# EAGLE design 8channelrelaydriver_smd (EAGLE 7.2.0)
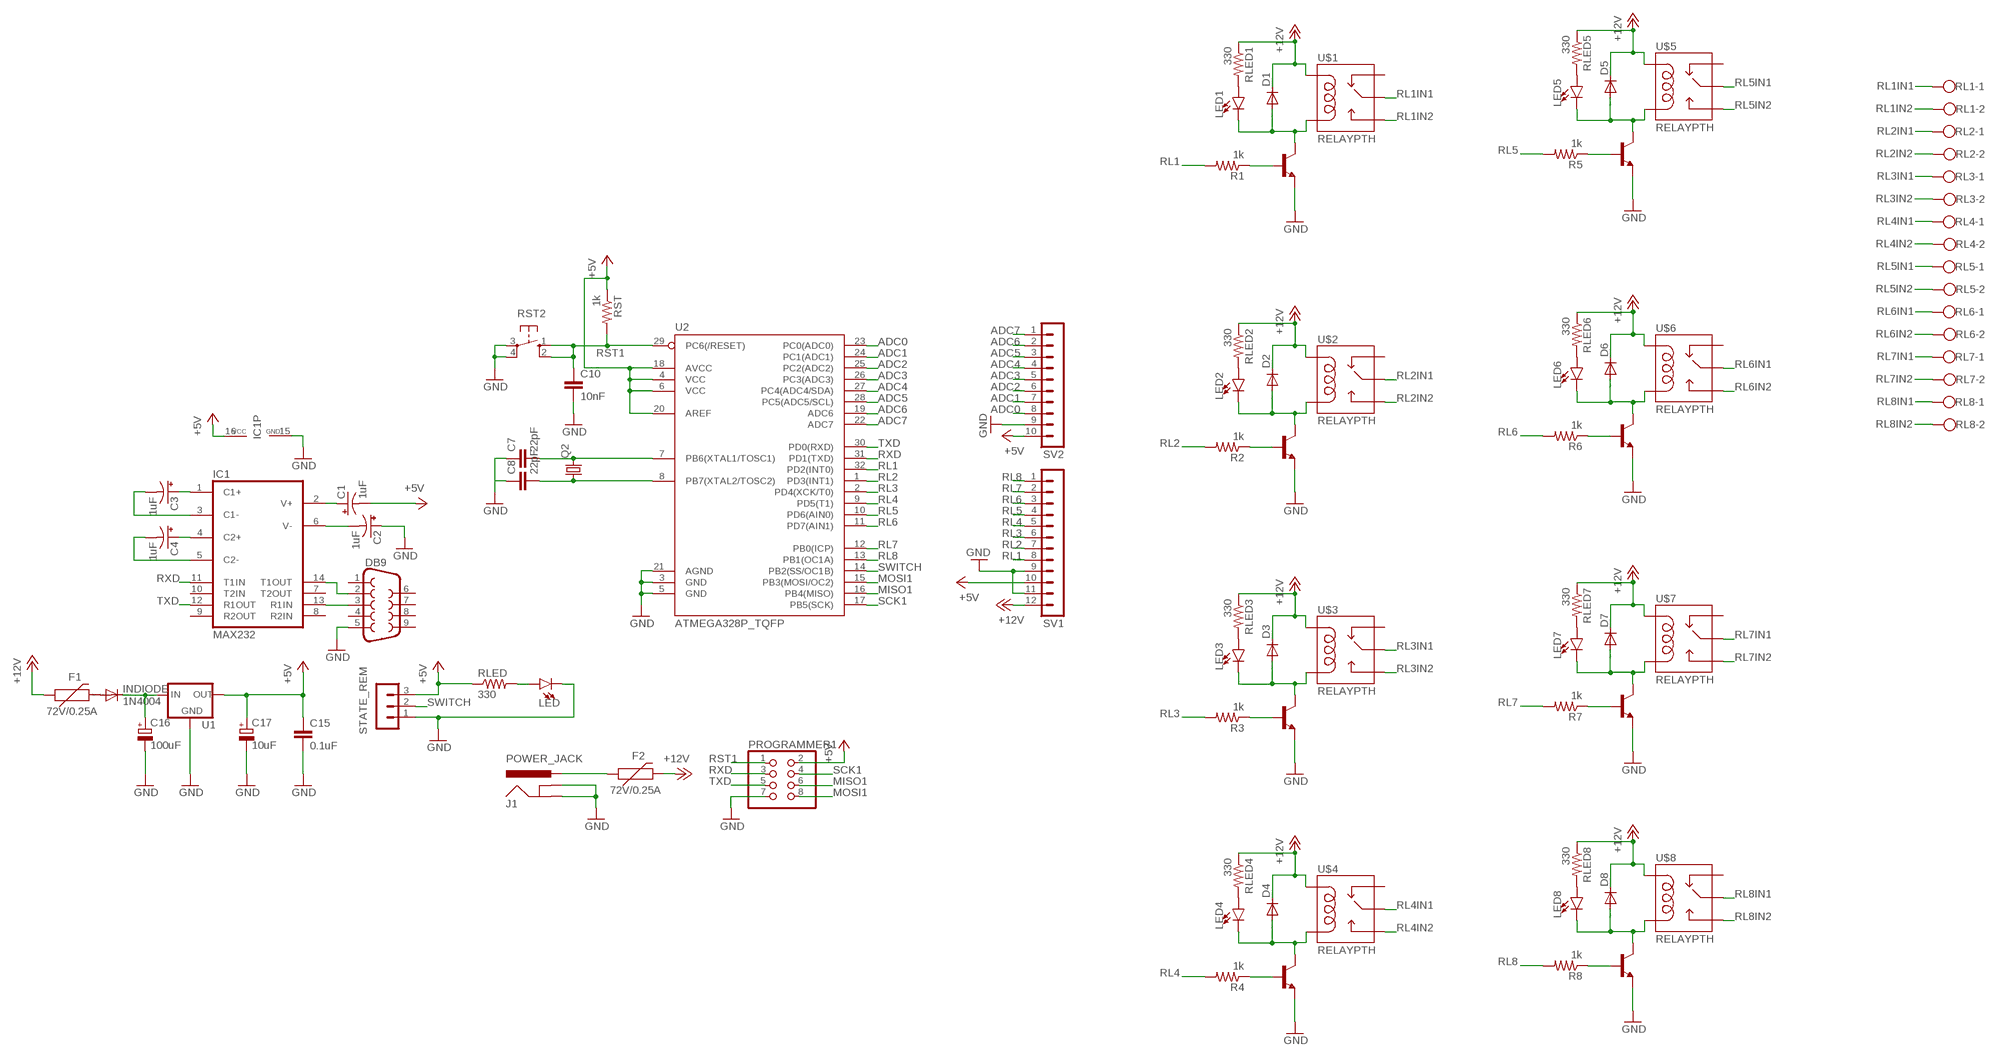
[diagram p0: schematic, sheet 1]

## Parts
C1  1uF  CPOL-USE2.5-6  [E2,5-6]
C2  1uF  CPOL-USE2.5-6  [E2,5-6]
C3  1uF  CPOL-USE2.5-6  [E2,5-6]
C4  1uF  CPOL-USE2.5-6  [E2,5-6]
C7  22pF  C-EUC1206  [C1206]
C8  22pF  C-EUC1206  [C1206]
C10  10nF  C-EUC1206  [C1206]
C15  0.1uF  C-EUC1206  [C1206]
C16  100uF  CPOL-EUE2.5-6  [E2,5-6]
C17  10uF  CPOL-EUE2.5-6  [E2,5-6]
D1  1N4004  [DO41-10]
D2  1N4004  [DO41-10]
D3  1N4004  [DO41-10]
D4  1N4004  [DO41-10]
D5  1N4004  [DO41-10]
D6  1N4004  [DO41-10]
D7  1N4004  [DO41-10]
D8  1N4004  [DO41-10]
DB9  DB9FEMALE  [DB9]
F1  72V/0.25A  PPTC_PTH  [PTH]
F2  72V/0.25A  PPTC_PTH  [PTH]
IC1  MAX232  [DIL16]
INDIODE  1N4004  [DO41-10]
J1  POWER_JACK  [POWER_JACK_PTH]
LED  LED5MM  [LED_5MM]
LED1  LED5MM  [LED_5MM]
LED2  LED5MM  [LED_5MM]
LED3  LED5MM  [LED_5MM]
LED4  LED5MM  [LED_5MM]
LED5  LED5MM  [LED_5MM]
LED6  LED5MM  [LED_5MM]
LED7  LED5MM  [LED_5MM]
LED8  LED5MM  [LED_5MM]
PROGRAMMER1  PINHD-2X4  [2X04]
Q2  CRYSTALHC49U70  [HC49U70]
R1  1k  R-US_M1206  [M1206]
R2  1k  R-US_M1206  [M1206]
R3  1k  R-US_M1206  [M1206]
R4  1k  R-US_M1206  [M1206]
R5  1k  R-US_M1206  [M1206]
R6  1k  R-US_M1206  [M1206]
R7  1k  R-US_M1206  [M1206]
R8  1k  R-US_M1206  [M1206]
RL1  W237-102  [W237-102]
RL2  W237-102  [W237-102]
RL3  W237-102  [W237-102]
RL4  W237-102  [W237-102]
RL5  W237-102  [W237-102]
RL6  W237-102  [W237-102]
RL7  W237-102  [W237-102]
RL8  W237-102  [W237-102]
RLED  330  R-US_M1206  [M1206]
RLED1  330  R-US_M1206  [M1206]
RLED2  330  R-US_M1206  [M1206]
RLED3  330  R-US_M1206  [M1206]
RLED4  330  R-US_M1206  [M1206]
RLED5  330  R-US_M1206  [M1206]
RLED6  330  R-US_M1206  [M1206]
RLED7  330  R-US_M1206  [M1206]
RLED8  330  R-US_M1206  [M1206]
RST  1k  R-US_M1206  [M1206]
RST2  10-XX  [B3F-10XX]
STATE_REM  MA03-1  [MA03-1]
SV1  MA12-1  [MA12-1]
SV2  MA10-1  [MA10-1]
T1  BC847  [SOT23]
T2  BC847  [SOT23]
T3  BC847  [SOT23]
T4  BC847  [SOT23]
T5  BC847  [SOT23]
T6  BC847  [SOT23]
T7  BC847  [SOT23]
T8  BC847  [SOT23]
U1  V_REG_78XXSIDE  [78XXL]
U2  ATMEGA328P_TQFP  [TQFP32-08]
U$1  RELAYPTH  [SRD-05VDC-SL-C]
U$2  RELAYPTH  [SRD-05VDC-SL-C]
U$3  RELAYPTH  [SRD-05VDC-SL-C]
U$4  RELAYPTH  [SRD-05VDC-SL-C]
U$5  RELAYPTH  [SRD-05VDC-SL-C]
U$6  RELAYPTH  [SRD-05VDC-SL-C]
U$7  RELAYPTH  [SRD-05VDC-SL-C]
U$8  RELAYPTH  [SRD-05VDC-SL-C]

## Nets
+12V: D1.C D2.C D3.C D4.C D5.C D6.C D7.C D8.C F1.P$1 F2.P$2 RLED1.1 RLED2.1 RLED3.1 RLED4.1 RLED5.1 RLED6.1 RLED7.1 RLED8.1 SV1.12 U$1.COIL1 U$2.COIL1 U$3.COIL1 U$4.COIL1 U$5.COIL1 U$6.COIL1 U$7.COIL1 U$8.COIL1
ADC0: SV2.8 U2.23(PC0(ADC0))
ADC1: SV2.7 U2.24(PC1(ADC1))
ADC2: SV2.6 U2.25(PC2(ADC2))
ADC3: SV2.5 U2.26(PC3(ADC3))
ADC4: SV2.4 U2.27(PC4(ADC4/SDA))
ADC5: SV2.3 U2.28(PC5(ADC5/SCL))
ADC6: SV2.2 U2.19(ADC6)
ADC7: SV2.1 U2.22(ADC7)
MISO1: PROGRAMMER1.6 U2.16(PB4(MISO))
MOSI1: PROGRAMMER1.8 U2.15(PB3(MOSI/OC2))
N$1: DB9.2 IC1.14(T1OUT)
N$2: LED.A RLED.2
N$3: C16.+ INDIODE.C U1.IN
N$4: D2.A LED2.K(C) T2.3(C) U$2.COIL0
N$5: D1.A LED1.K(C) T1.3(C) U$1.COIL0
N$6: R1.1 T1.1(B)
N$7: R2.1 T2.1(B)
N$8: D3.A LED3.K(C) T3.3(C) U$3.COIL0
N$9: R3.1 T3.1(B)
N$10: D4.A LED4.K(C) T4.3(C) U$4.COIL0
N$11: R4.1 T4.1(B)
N$12: D5.A LED5.K(C) T5.3(C) U$5.COIL0
N$13: R5.1 T5.1(B)
N$14: D6.A LED6.K(C) T6.3(C) U$6.COIL0
N$15: R6.1 T6.1(B)
N$16: D7.A LED7.K(C) T7.3(C) U$7.COIL0
N$17: R7.1 T7.1(B)
N$18: C1.+ IC1.2(V+)
N$19: D8.A LED8.K(C) T8.3(C) U$8.COIL0
N$20: C2.- IC1.6(V-)
N$21: C7.2 Q2.2 U2.7(PB6(XTAL1/TOSC1))
N$22: C8.2 Q2.1 U2.8(PB7(XTAL2/TOSC2))
N$23: C3.+ IC1.1(C1+)
N$24: C4.+ IC1.4(C2+)
N$25: C4.- IC1.5(C2-)
N$26: C3.- IC1.3(C1-)
N$27: R8.1 T8.1(B)
N$28: F1.P$2 INDIODE.A
N$29: LED1.A RLED1.2
N$30: F2.P$1 J1.PWR
N$32: LED2.A RLED2.2
N$34: LED3.A RLED3.2
N$36: LED4.A RLED4.2
N$38: LED5.A RLED5.2
N$40: LED6.A RLED6.2
N$42: LED7.A RLED7.2
N$44: LED8.A RLED8.2
PIN13: DB9.3 IC1.13(R1IN)
RL1: R1.2 SV1.8 U2.32(PD2(INT0))
RL1IN1: RL1.1 U$1.SWCOMMON
RL1IN2: RL1.2 U$1.SWOPEN
RL2: R2.2 SV1.7 U2.1(PD3(INT1))
RL2IN1: RL2.1 U$2.SWCOMMON
RL2IN2: RL2.2 U$2.SWOPEN
RL3: R3.2 SV1.6 U2.2(PD4(XCK/T0))
RL3IN1: RL3.1 U$3.SWCOMMON
RL3IN2: RL3.2 U$3.SWOPEN
RL4: R4.2 SV1.5 U2.9(PD5(T1))
RL4IN1: RL4.1 U$4.SWCOMMON
RL4IN2: RL4.2 U$4.SWOPEN
RL5: R5.2 SV1.4 U2.10(PD6(AIN0))
RL5IN1: RL5.1 U$5.SWCOMMON
RL5IN2: RL5.2 U$5.SWOPEN
RL6: R6.2 SV1.3 U2.11(PD7(AIN1))
RL6IN1: RL6.1 U$6.SWCOMMON
RL6IN2: RL6.2 U$6.SWOPEN
RL7: R7.2 SV1.2 U2.12(PB0(ICP))
RL7IN1: RL7.1 U$7.SWCOMMON
RL7IN2: RL7.2 U$7.SWOPEN
RL8: R8.2 SV1.1 U2.13(PB1(OC1A))
RL8IN1: RL8.1 U$8.SWCOMMON
RL8IN2: RL8.2 U$8.SWOPEN
RST1: C10.1 PROGRAMMER1.1 RST2.1(S) RST2.2(S1) RST.2 U2.29(PC6(/RESET))
RXD: IC1.11(T1IN) PROGRAMMER1.3 U2.31(PD1(TXD))
SCK1: PROGRAMMER1.4 U2.17(PB5(SCK))
SWITCH: STATE_REM.2 U2.14(PB2(SS/OC1B))
TXD: IC1.12(R1OUT) PROGRAMMER1.5 U2.30(PD0(RXD))
VDD: C1.- C15.1 C17.+ IC1.16(VCC) PROGRAMMER1.2 RLED.1 RST.1 STATE_REM.3 SV1.10 SV2.10 U1.OUT U2.4(VCC) U2.6(VCC) U2.18(AVCC) U2.20(AREF) ; supply symbol labelled +5V
VSS: C2.+ C7.1 C8.1 C10.2 C15.2 C16.- C17.- DB9.5 IC1.15(GND) J1.GND J1.GNDBREAK LED.K(C) PROGRAMMER1.7 RST2.3(P) RST2.4(P1) STATE_REM.1 SV1.9 SV1.11 SV2.9 T1.2(E) T2.2(E) T3.2(E) T4.2(E) T5.2(E) T6.2(E) T7.2(E) T8.2(E) U1.GND U2.3(GND) U2.5(GND) U2.21(AGND) ; supply symbol labelled GND
Unconnected: DB9.1 DB9.4 DB9.6 DB9.7 DB9.8 DB9.9 IC1.7(T2OUT) IC1.8(R2IN) IC1.9(R2OUT) IC1.10(T2IN) U$1.SWCLOSED(SWCLOSE) U$2.SWCLOSED(SWCLOSE) U$3.SWCLOSED(SWCLOSE) U$4.SWCLOSED(SWCLOSE) U$5.SWCLOSED(SWCLOSE) U$6.SWCLOSED(SWCLOSE) U$7.SWCLOSED(SWCLOSE) U$8.SWCLOSED(SWCLOSE)

## Library data of the parts
C1-C4 = rcl:CPOL-US: POLARIZED CAPACITOR, American symbol
C7 C8 C10 C15 = resistor:C-EU: CAPACITOR, European symbol
C16 C17 = rcl:CPOL-EU: POLARIZED CAPACITOR, European symbol
D1-D8 INDIODE = diode:1N4004: DIODE general purpose rectifier, 1 A
DB9 = SparkFun-Connectors:DB9: DB9 Connector Standard DB9 (D-Sub 9) serial connector. Can be used for CAN bus as well as RS485 and RS232. Footprint production proven. Here is the female version connector we sell at SparkFun: 9 Pin Female Serial Connector - PCB Mount <https://www.sparkfun.com/products/429> (PRT-00429) This connector has been used on the following SparkFun products: SparkFun RS232 Shifter - SMD <https://www.sparkfun.com/products/449> (PRT-00449) SparkFun RS232 Shifter SMD (No DB9) <https://www.sparkfun.com/products/8780> (PRT-08780); PROD_ID: CONN-08194
F1 F2 = SparkFun-Fuses:PPTC: Resettable Fuse PPTC Resettable Fuse. Really a sort of resistor with a polymeric positive temperature coefficient whose resistance increases dramatically with an increase in temperature. When heated by the power passing through the resistance rises causing the current to be limited, protecting the circuit. This is achieved by the transition of the polymer from a crystalline to an amorphous state where the conductive carbon separates breaking the conductive pathways found in the cool crystalline structure. When a PPTC cools back down it resumes conducting letting the circuit turn back on. SparkFun Products: SparkFun RedBoard - Programmed with Arduino <https://www.sparkfun.com/products/12757> Pro Micro - 5V/16MHz <https://www.sparkfun.com/products/12640> Arduino Pro 328 - 5V/16MHz <https://www.sparkfun.com/products/10915> MP3 Trigger <https://www.sparkfun.com/products/13720>; PROD_ID: RES-08490
IC1 = maxim:MAX232: RS232 TRANSCEIVER; MF: MAXIM; MPN: MAX232ACPE+; OC_FARNELL: 9723773; OC_NEWARK: 68K4544
J1 = SparkFun-Connectors:POWER_JACK: Power Jack Connector This is the standard 5.5mm barrel jack for power. The PTH is the most common, proven, reliable, footprint. The Slot footprint only works if the mill layer is transmitted to the PCB fab house so be warned. Here are the connectors we sell at SparkFun: DC Barrel Power Jack/Connector <https://www.sparkfun.com/products/119> (PRT-00119) DC Barrel Power Jack/Connector (SMD) <https://www.sparkfun.com/products/12748> (PRT-12748) DC Barrel Jack Adapter - Breadboard Compatible <https://www.sparkfun.com/products/10811> (PRT-10811) It is used on this SparkFun product (and many, many others): SparkFun RedBoard - Programmed with Arduino <https://www.sparkfun.com/products/12757> (DEV-12757) Also, if you need a mating power supply or connector, please check these out: Wall Adapter Power Supply - 9VDC 650mA <https://www.sparkfun.com/products/298> (TOL-00298) DC Barrel Jack Adapter - Male <https://www.sparkfun.com/products/10287> (PRT-10287); PROD_ID: CONN-08197
LED LED1-LED8 = SparkFun-LED:LED: LED (Generic) Standard schematic elements and footprints for 5mm, 3mm, 1206, and 0603 sized LEDs. Generic LEDs with no color specified.
PROGRAMMER1 = pinhead:PINHD-2X4: PIN HEADER
Q2 = crystal:CRYSTAL: CRYSTAL; OC_FARNELL: unknown; OC_NEWARK: unknown
R1-R8 RLED RLED1-RLED8 RST = resistor:R-US_: RESISTOR, American symbol
RL1-RL8 = con-wago-500:W237-102: WAGO SCREW CLAMP; MPN: 237-102; OC_FARNELL: unknown; OC_NEWARK: 70K9898
RST2 = switch-omron:10-XX: OMRON SWITCH; MPN: B3F-1000; OC_FARNELL: 176432; OC_NEWARK: 36M3542
STATE_REM = con-lstb:MA03-1: PIN HEADER; OC_FARNELL: unknown; OC_NEWARK: unknown
SV1 = con-lstb:MA12-1: PIN HEADER; OC_FARNELL: unknown; OC_NEWARK: unknown
SV2 = con-lstb:MA10-1: PIN HEADER; OC_FARNELL: unknown; OC_NEWARK: unknown
T1-T8 = transistor:BC847: NPN TRANSISTOR
U1 = SparkFun-IC-Power:V_REG_78XX: Voltage Regulator Standard 78xx regulator. IGO (Input Ground Output). Spark Fun Electronics SKU : COM-00107
U2 = SparkFun-IC-Microcontroller:ATMEGA328P_TQFP: Popular 328P in QFP Storefront component: ATmega328 - TQFP <https://www.sparkfun.com/products/13448> (COM-13448) Datasheet <http://www.sparkfun.com/datasheets/Components/SMD/ATMega328.pdf> SparkFun Products SparkFun RedBoard - Programmed with Arduino <https://www.sparkfun.com/products/12757> (DEV-12757) Arduino Pro Mini 328 - 5V/16MHz <https://www.sparkfun.com/products/11113> (DEV-11113) Arduino Pro Mini 328 - 3.3V/8MHz <https://www.sparkfun.com/products/11114> (DEV-11114) SparkFun OpenLog <https://www.sparkfun.com/products/13712> (DEV-13712) SparkFun MicroView - OLED Arduino Module <https://www.sparkfun.com/products/12923> (DEV-12923) SparkFun Digital Sandbox <https://www.sparkfun.com/products/12651> (DEV-12651) SparkFun PicoBoard <https://www.sparkfun.com/products/11888> (WIG-11888) Arduino Fio <https://www.sparkfun.com/products/10116> (DEV-10116) LilyPad Arduino 328 Main Board <https://www.sparkfun.com/products/13342> (DEV-13342) SparkFun RedStick <https://www.sparkfun.com/products/13741> (DEV-13741) LilyPad MP3 <https://www.sparkfun.com/products/11013> (DEV-11013) LilyPad Arduino SimpleSnap <https://www.sparkfun.com/products/10941> (DEV-10941) SparkFun Stepoko <https://www.sparkfun.com/products/13899> (ROB-13899) SparkFun Geiger Counter <https://www.sparkfun.com/products/11345> (SEN-11345) SparkFun EL Sequencer <https://www.sparkfun.com/products/12781> (COM-12781) Arduino Pro 328 - 5V/16MHz <https://www.sparkfun.com/products/10915> (DEV-10915) CryptoCape <https://www.sparkfun.com/products/12773> (DEV-12773) SparkFun IR Thermometer Evaluation Board - MLX90614 <https://www.sparkfun.com/products/10740> (SEN-10740) SparkFun RedBot Mainboard <https://www.sparkfun.com/products/12097> (ROB-12097) Arduino Pro 328 - 3.3V/8MHz <https://www.sparkfun.com/products/10914> (DEV-10914) SparkFun Block for Intel® Edison - Arduino <https://www.sparkfun.com/products/13036> (DEV-13036) SparkFun Simon Says - Surface Mount Soldering Kit <https://www.sparkfun.com/products/10935> (KIT-10935) SparkFun 7-Segment Serial Display - Red <https://www.sparkfun.com/products/11441> (COM-11441) SparkFun 7-Segment Serial Display - White <https://www.sparkfun.com/products/11629> (COM-11629) SparkFun 7-Segment Serial Display - Yellow <https://www.sparkfun.com/products/11443> (COM-11443) SparkFun 7-Segment Serial Display - Kelly Green <https://www.sparkfun.com/products/11440> (COM-11440) SparkFun 7-Segment Serial Display - Blue <https://www.sparkfun.com/products/11442> (COM-11442) SparkFun OpenSegment Serial Display - 20mm (Blue) <https://www.sparkfun.com/products/11647> (COM-11647) SparkFun OpenSegment Serial Display - 20mm (Green) <https://www.sparkfun.com/products/11646> (COM-11646) SparkFun OpenSegment Serial Display - 20mm (White) <https://www.sparkfun.com/products/11648> (COM-11648) SparkFun OpenSegment Serial Display - 20mm (Red) <https://www.sparkfun.com/products/11644> (COM-11644) SparkFun OpenSegment Serial Display - 20mm (Yellow) <https://www.sparkfun.com/products/11645> (COM-11645) SparkFun OpenSegment Shield <https://www.sparkfun.com/products/13190> (DEV-13190); PROD_ID: IC-09069
U$1-U$8 = SRD-05VDC-SL-C:RELAY: SPDT relay (COM-00101)

## Board
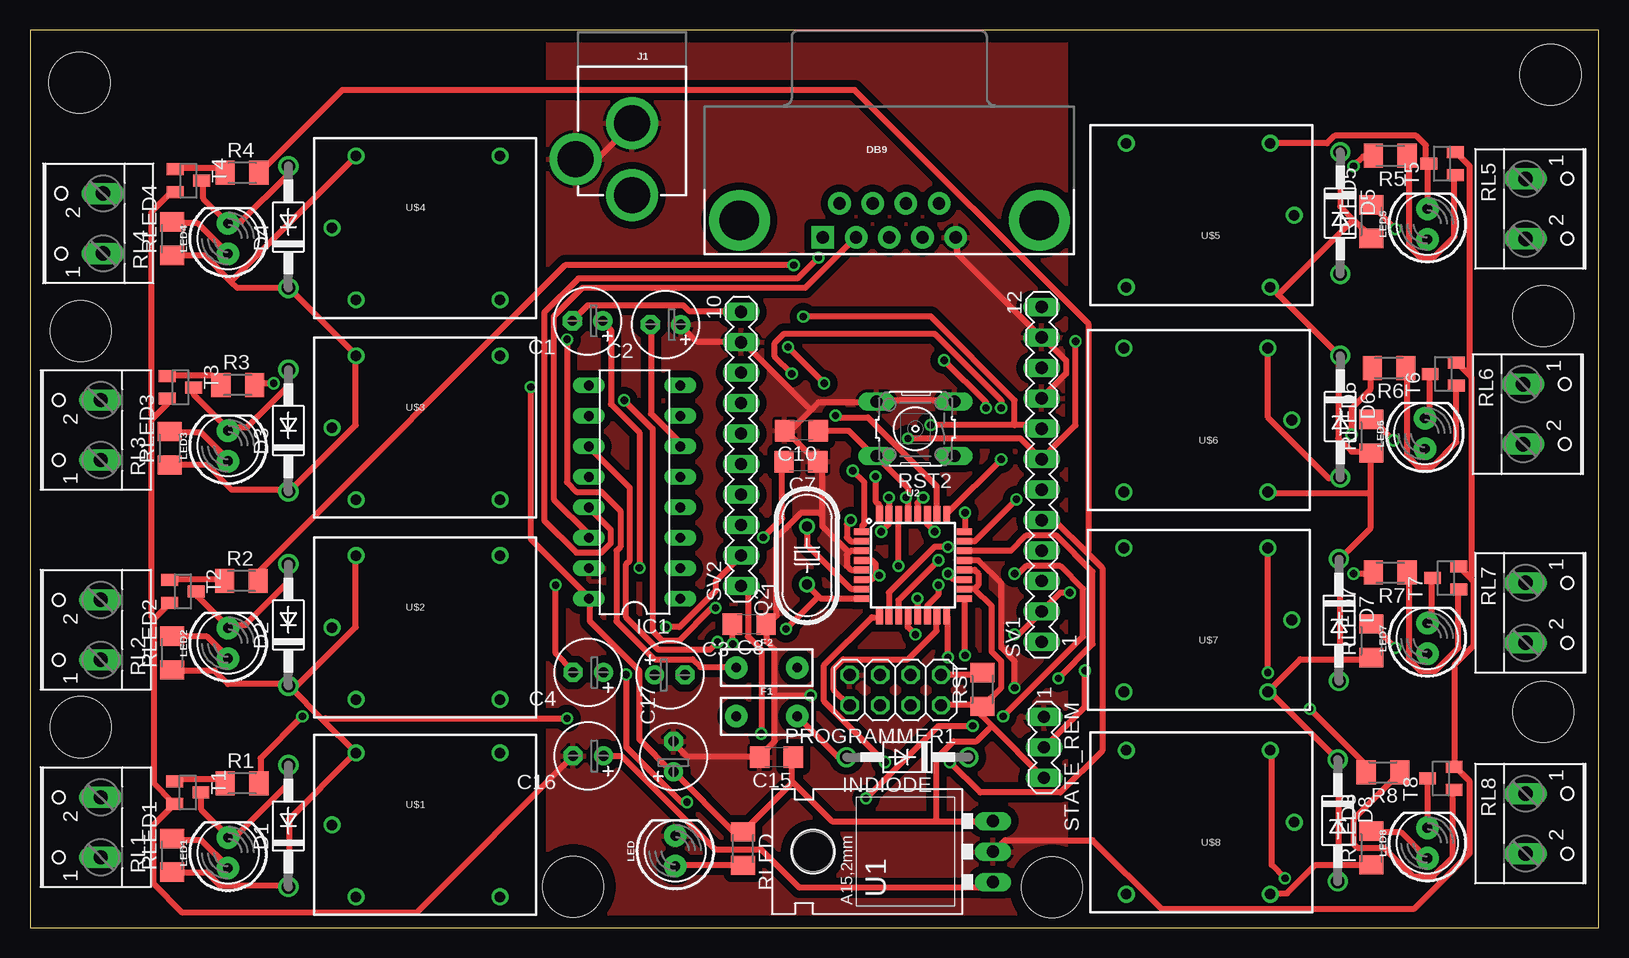
[diagram p1: board, top side]
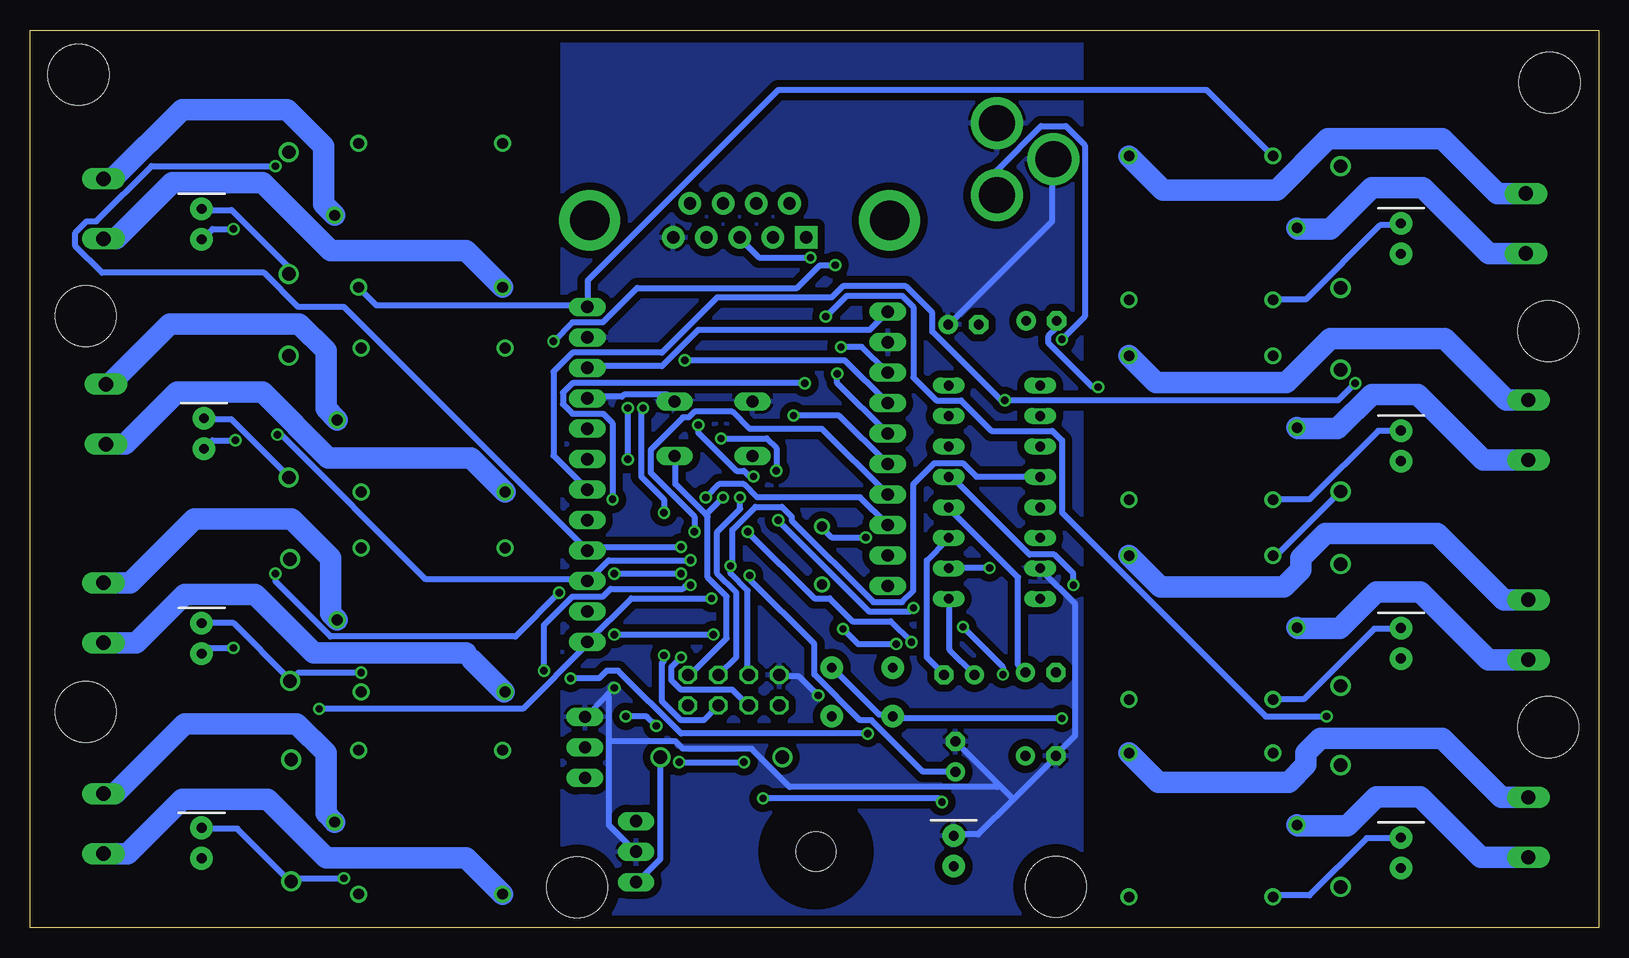
[diagram p2: board, bottom side, seen from below]

Size 130.79 x 74.85 mm. Coordinates in mm from the lower left corner, seen from the top.
Outline: 0,0 130.79,0 130.79,74.85 0,74.85 0,0
Copper layers (1*16): Top 0.035mm / dielectric 1.5mm / Bottom 0.035mm
Design rules "default *": minimum track width 20mil, minimum drill 24mil, track to track 8mil, track to pad 8mil, pad to pad 8mil, via to via 8mil, smd to smd 8mil, copper to edge 40mil, drill to drill 8mil, minimum pad ring 10mil, minimum via ring 8mil, stop-mask expansion 4mil, vias tented up to drill 0mil, thermal gap 10mil
Holes 5.08 mm at 4.12,70.47 126.75,71.13 85.2,3.36 45.27,3.41 4.22,49.74 4.22,16.72 126.14,17.99 126.14,51.01

### Footprints (pad centres in the part's own frame; a part is rotated, then mirrored left to right if it is on the bottom)
E2,5-6 = drill 0.813 pad 1.6: + -1.27,0 | drill 0.813 pad 1.6 octagon: - 1.27,0
C1206 = smd 1.6 x 1.8: 1 -1.4,0; 2 1.4,0
DO41-10 = drill 1.118: A 5.08,0; C -5.08,0
DB9 = drill 1.016 pad 1.88 square: 1 -5.54,-1.42 | drill 1.016 pad 1.88: 2 -2.77,-1.42; 3 0,-1.42; 4 2.77,-1.42; 5 5.54,-1.42; 6 -4.15,1.42; 7 -1.38,1.42; 8 1.38,1.42; 9 4.15,1.42 | drill 3.302 pad 5.08: G1 -12.5,0; G2 12.5,0
PTH = drill 0.8 pad 1.88: P$1 -2.54,0; P$2 2.54,0
DIL16 = drill 0.813 long: 1 -8.89,-3.81; 2 -6.35,-3.81; 3 -3.81,-3.81; 4 -1.27,-3.81; 5 1.27,-3.81; 6 3.81,-3.81; 7 6.35,-3.81; 8 8.89,-3.81; 9 8.89,3.81; 10 6.35,3.81; 11 3.81,3.81; 12 1.27,3.81; 13 -1.27,3.81; 14 -3.81,3.81; 15 -6.35,3.81; 16 -8.89,3.81
POWER_JACK_PTH = drill 2.997 pad 4.318: GND 0,7.7; GNDBREAK 4.7,10.7; PWR 0,13.7
LED_5MM = drill 0.813 pad 1.88: A -1.27,0; K 1.27,0
2X04 = drill 1.016 octagon: 1 -3.81,-1.27; 2 -3.81,1.27; 3 -1.27,-1.27; 4 -1.27,1.27; 5 1.27,-1.27; 6 1.27,1.27; 7 3.81,-1.27; 8 3.81,1.27
HC49U70 = drill 0.813: 1 -2.413,0; 2 2.413,0
M1206 = smd 1.6 x 2: 1 -1.4,0; 2 1.4,0
W237-102 = drill 1.194 long: 1 -2.5,-1.27; 2 2.5,-1.27
B3F-10XX = drill 1.016 long: 1 -3.251,2.261; 2 3.251,2.261; 3 -3.251,-2.261; 4 3.251,-2.261
MA03-1 = drill 1.016 long: 1 -2.54,0; 2 0,0; 3 2.54,0
MA12-1 = drill 1.016 long: 1 -13.97,0; 2 -11.43,0; 3 -8.89,0; 4 -6.35,0; 5 -3.81,0; 6 -1.27,0; 7 1.27,0; 8 3.81,0; 9 6.35,0; 10 8.89,0; 11 11.43,0; 12 13.97,0
MA10-1 = drill 1.016 long: 1 -11.43,0; 2 -8.89,0; 3 -6.35,0; 4 -3.81,0; 5 -1.27,0; 6 1.27,0; 7 3.81,0; 8 6.35,0; 9 8.89,0; 10 11.43,0
SOT23 = smd 1 x 1.4: 1 -0.95,-1.1; 2 0.95,-1.1; 3 0,1.1
78XXL = drill 1.016 long: GND 0,-3.81; IN -2.54,-3.81; OUT 2.54,-3.81 | hole 3.302: 0,11.176
TQFP32-08 = smd 1.27 x 0.559: 1 -4.293,2.8; 2 -4.293,2; 3 -4.293,1.2; 4 -4.293,0.4; 5 -4.293,-0.4; 6 -4.293,-1.2; 7 -4.293,-2; 8 -4.293,-2.8; 17 4.293,-2.8; 18 4.293,-2; 19 4.293,-1.2; 20 4.293,-0.4; 21 4.293,0.4; 22 4.293,1.2; 23 4.293,2; 24 4.293,2.8 | smd 0.559 x 1.27: 9 -2.8,-4.293; 10 -2,-4.293; 11 -1.2,-4.293; 12 -0.4,-4.293; 13 0.4,-4.293; 14 1.2,-4.293; 15 2,-4.293; 16 2.8,-4.293; 25 2.8,4.293; 26 2,4.293; 27 1.2,4.293; 28 0.4,4.293; 29 -0.4,4.293; 30 -1.2,4.293; 31 -2,4.293; 32 -2.8,4.293
SRD-05VDC-SL-C = drill 0.9: COIL0 -5.39,-6.12; COIL1 -5.39,5.88; SWCLOSED 6.61,-6.12; SWCOMMON -7.39,-0.12; SWOPEN 6.61,5.88

### Placement (x,y rotation side)
C1  46.48,50.6 180 top
C2  52.98,50.29 180 top
C3  53.34,21.08 0 top
C4  46.53,21.29 180 top
C7  64.26,38.86 180 top
C8  59.94,25.3 180 top
C10  64.31,41.45 180 top
C15  62.23,14.22 180 top
C16  46.53,14.33 180 top
C17  53.64,14.27 90 top
D1  21.54,8.48 90 top
D2  21.54,25.25 90 top
D3  21.54,41.45 90 top
D4  21.54,58.42 90 top
D5  109.22,59.59 270 top
D6  109.22,42.62 270 top
D7  109.12,25.65 270 top
D8  109.02,8.94 270 top
DB9  71.63,58.98 0 top
F1  61.42,17.63 0 top
F2  61.42,21.69 0 top
IC1  50.39,36.32 90 top
INDIODE  73.15,14.22 180 top
J1  50.19,74.78 180 top
LED  53.8,6.4 90 top
LED1  16.51,6.25 90 top
LED2  16.51,23.72 90 top
LED3  16.51,40.18 90 top
LED4  16.51,57.45 90 top
LED5  116.48,58.67 90 top
LED6  116.28,41.2 90 top
LED7  116.48,24.13 90 top
LED8  116.48,7.06 90 top
PROGRAMMER1  72.14,19.81 180 top
Q2  64.77,31.04 90 top
R1  17.68,12.04 0 top
R2  17.63,28.91 0 top
R3  17.32,45.26 0 top
R4  17.68,62.94 0 top
R5  113.39,64.36 180 top
R6  113.28,46.69 180 top
R7  113.39,29.62 180 top
R8  112.78,12.95 180 top
RL1  4.62,8.38 90 top
RL2  4.62,24.84 90 top
RL3  4.62,41.5 90 top
RL4  4.83,58.72 90 top
RL5  125.93,59.94 270 top
RL6  125.73,42.82 270 top
RL7  125.93,26.26 270 top
RL8  125.93,8.69 270 top
RLED  59.44,6.6 270 top
RLED1  11.84,6.05 90 top
RLED2  11.84,22.91 90 top
RLED3  11.63,39.98 90 top
RLED4  11.84,57.45 90 top
RLED5  111.81,58.88 90 top
RLED6  111.81,41 90 top
RLED7  111.81,23.93 90 top
RLED8  111.81,6.65 90 top
RST  79.4,19.86 90 top
RST2  73.81,41.61 180 top
STATE_REM  84.53,15.04 270 top
SV1  84.33,37.8 90 top
SV2  59.28,39.93 90 top
T1  13.16,11.28 270 top
T2  12.75,28.04 270 top
T3  12.55,45.06 270 top
T4  13.21,62.28 270 top
T5  117.7,63.7 90 top
T6  117.81,46.18 90 top
T7  118.01,29.16 90 top
T8  117.6,12.45 90 top
U1  76.45,6.35 90 top
U2  73.61,30.23 0 top
U$1  32.56,8.69 0 top
U$2  32.56,25.15 0 top
U$3  32.56,41.81 0 top
U$4  32.56,58.47 0 top
U$5  97.99,59.28 180 top
U$6  97.79,42.21 180 top
U$7  97.79,25.55 180 top
U$8  97.99,8.69 180 top

### Tracks (layer width: path | path; a pad name or v marks a point on that pad's centre or on a via)
+12V  (via drill 0.61)
  Top 0.508: 111.76,36.2 111.76,33.34 109.22,30.8 D7.C 109.22,30.64 109.22,22.38 | 111.76,36.2 111.76,39.53 RLED6.1 111.6,39.69 110.17,39.69 109.06,40.8 109.06,47.47 D6.C 109.22,47.62 104.06,52.78 | 111.76,36.2 103.19,36.2 U$6.COIL1 | 109.06,5.24 107.16,5.24 104.78,2.86 103.5,2.86 U$8.COIL1 | 109.06,5.24 111.76,5.24 RLED8.1 | 109.22,22.38 105.89,22.38 103.19,19.69 U$7.COIL1 103.35,19.69 108.9,14.13 D8.C 109.06,13.81 109.06,5.24 | 109.22,22.38 111.76,22.38 RLED7.1 | 110.33,59.06 109.22,60.17 D5.C | 110.33,59.06 111.76,57.63 RLED5.1 | 104.06,52.78 103.5,53.34 U$5.COIL1 | 104.06,52.78 110.33,59.06 | 16.75,53.9 17.3,53.34 D4.C 21.59,53.34 27.15,47.78 U$3.COIL1 27.15,47.47 27.15,41.91 21.75,36.51 D3.C 21.43,36.51 16.83,36.51 14.76,38.58 11.75,38.58 RLED3.1 | 16.75,53.9 14.6,56.04 11.91,56.04 RLED4.1 | 16.75,53.9 27.15,64.29 U$4.COIL1 | RLED1.1 11.91,4.6 14.76,4.6 15.87,3.49 21.43,3.49 D1.C 21.59,3.65 21.59,9.05 26.99,14.45 U$1.COIL1 27.15,14.61 24.45,17.3 | RLED2.1 11.91,21.43 15.4,21.43 16.51,20.32 21.43,20.32 D2.C | 24.45,17.3 21.59,20.16 D2.C | v44.77,17.46 24.61,17.46 24.45,17.3 | U$2.COIL1 27.15,30.96 27.15,25.08 22.07,20 D2.C
  Bottom 0.508: U$5.COIL1 103.35,53.34 101.92,51.91 84.45,51.91 SV1.12 84.3,52.07 84.3,53.97 68.42,69.85 32.7,69.85 27.3,64.45 U$4.COIL1 | U$2.COIL1 27.15,31.12 26.83,31.12 21.59,36.35 D3.C | F2.P$2 63.82,21.59 60.01,17.78 58.9,17.78 F1.P$1 58.74,17.46 v44.77,17.46
ADC0  (via drill 0.61)
  Top 0.508: v82.23,35.72 78.74,32.23 77.95,32.23 U2.23 | v63.18,48.42 v66.2,45.4
  Bottom 0.508: v82.23,35.72 82.23,42.07 83.03,42.86 85.57,42.86 86.36,43.66 86.36,44.61 85.57,45.4 v66.2,45.4 | v63.18,48.42 61.44,48.42 59.37,46.36 SV2.8
ADC1  (via drill 0.61)
  Top 0.508: v77.95,34.61 77.95,33.18 U2.24 | v79.69,43.34 79.69,43.81 v76.2,47.31
  Bottom 0.508: v77.95,34.61 77.95,35.72 79.85,37.62 79.85,43.18 v79.69,43.34 | v76.2,47.31 62.86,47.31 59.37,43.81 SV2.7
ADC2  (via drill 0.61)
  Top 0.508: v80.96,39.05 76.52,34.61 U2.25 | v80.96,43.34 80.96,43.97 75.41,49.53 62.86,49.53 62.07,48.74 62.07,47.62 v63.5,46.2
  Bottom 0.508: v80.96,43.34 v80.96,39.05 | v63.5,46.2 63.5,45.4 59.37,41.28 SV2.6
ADC3  (via drill 0.61)
  Top 0.508: v67.15,42.7 67.31,42.55 69.85,42.55 75.56,36.83 75.56,34.61 U2.26
  Bottom 0.508: v67.15,42.7 63.34,42.7 59.37,38.73 SV2.5
ADC4  (via drill 0.61)
  Top 0.508: v75.41,33.02 74.77,33.66 74.77,34.45 U2.27
  Bottom 0.508: v75.41,33.02 75.41,34.29 79.06,37.94 79.06,39.85 76.36,42.55 75.88,42.55 75.41,43.02 72.23,43.02 70.8,41.59 64.77,41.59 59.37,36.2 SV2.4
ADC5  (via drill 0.61)
  Top 0.508: v74.45,35.88 73.98,35.4 73.98,34.61 U2.28
  Bottom 0.508: v74.45,35.88 73.34,36.99 71.28,36.99 70.17,35.88 61.59,35.88 59.37,33.66 SV2.3
ADC6  (via drill 0.61)
  Top 0.508: v76.52,29.53 76.99,29.05 77.79,29.05 U2.19 | v82.07,29.53 82.39,29.53 83.03,30.16 85.88,30.16 87.79,28.26 87.79,24.29 v81.12,17.62 | v78.58,16.83 75.72,16.83 v69.69,10.79 | v54.77,10.48 54.29,10.48 49.69,15.08 v49.69,21.11 | v53.02,25.08 54.13,25.08 57.15,28.1 57.15,28.89 59.21,30.96 SV2.2
  Bottom 0.508: v82.07,29.53 v76.52,29.53 | v81.12,17.62 79.38,17.62 v78.58,16.83 | v69.69,10.79 55.09,10.79 v54.77,10.48 | v49.69,21.11 49.69,21.75 v53.02,25.08
ADC7  (via drill 0.61)
  Top 0.508: v85.72,20.8 88.58,23.65 88.58,29.69 85.57,32.7 83.03,32.7 81.76,31.43 77.95,31.43 U2.22 | v60.96,16.19 60.96,23.18 59.85,24.29 59.85,27.94 59.37,28.42 SV2.1
  Bottom 0.508: v85.72,20.8 83.34,20.8 82.71,21.43 81.76,21.43 76.52,16.19 v60.96,16.19
MISO1  (via drill 0.61)
  Top 0.508: v76.52,22.54 76.52,25.88 U2.16
  Bottom 0.508: v76.52,22.54 77.31,21.75 77.31,20.64 76.52,19.84 72.23,19.84 70.96,18.57 PROGRAMMER1.6
MOSI1
  Top 0.508: U2.15 75.56,25.88 75.56,24.77 73.18,22.38 67.79,22.38 66.99,21.59 66.99,19.84 68.26,18.57 PROGRAMMER1.8
N$1
  Top 0.508: IC1.14 46.51,32.54 46.51,32.86 43.66,35.72 43.66,50.96 46.04,53.34 64.61,53.34 68.74,57.47 DB9.2
N$2
  Top 0.508: RLED.2 59.37,5.24 53.82,5.24 LED.A
N$3
  Top 0.508: C16.+ 47.94,14.29 49.37,14.29 57.15,6.51 60.96,6.51 64.13,3.33 79.69,3.33 80.17,3.81 U1.IN
  Bottom 0.508: U1.IN 80.17,3.81 78.26,5.71 78.26,14.13 INDIODE.C
N$4
  Top 0.508: T2.3 13.97,27.94 13.97,27.62 16.51,25.08 LED2.K 16.67,25.24 17.94,25.24 21.43,28.73 21.43,30.32 D2.A
  Bottom 0.508: U$2.COIL0 27.15,19.05 24.61,19.05 18.73,24.92 16.51,24.92 LED2.K
N$5
  Top 0.508: T1.3 14.29,11.27 14.29,9.84 16.51,7.62 LED1.K 16.67,7.78 17.3,7.78 21.43,11.91 21.43,13.49 D1.A
  Bottom 0.508: U$1.COIL0 27.15,2.7 24.13,2.7 19.37,7.46 16.51,7.46 LED1.K
N$6
  Top 0.508: T1.1 12.06,12.38 15.87,12.38 16.19,12.07 R1.1
N$7
  Top 0.508: 11.75,29.05 T2.1 11.91,29.05 16.03,29.05 R2.1 16.19,29.05
N$8
  Top 0.508: T3.3 13.65,44.93 13.65,44.45 16.51,41.59 LED3.K 16.67,41.75 18.1,41.75 21.43,45.09 21.43,46.51 D3.A
  Bottom 0.508: U$3.COIL0 27.15,35.72 24.13,35.72 18.41,41.43 16.51,41.43 LED3.K
N$9
  Top 0.508: T3.1 11.59,46.04 15.24,46.04 15.87,45.4 R3.1
N$10
  Top 0.508: T4.3 14.45,62.23 14.45,60.8 16.51,58.74 LED4.K 16.67,58.9 17.62,58.9 21.43,62.71 21.43,63.5 D4.A
  Bottom 0.508: U$4.COIL0 27.15,52.39 24.45,52.39 18.26,58.58 16.51,58.58 LED4.K
N$11
  Top 0.508: T4.1 12.22,63.34 15.87,63.34 16.19,63.02 R4.1
N$12
  Top 0.508: LED5.K 116.52,60.01 116.52,63.66 T5.3 116.36,63.82 116.36,65.25 115.57,66.04 108.74,66.04 108.11,65.41 103.5,65.41 U$5.COIL0
  Bottom 0.508: D5.A 109.22,55.09 113.98,59.85 116.36,59.85 LED5.K
N$13
  Top 0.508: T5.1 118.74,62.71 118.74,57.63 117,55.88 115.89,55.88 114.94,56.83 114.94,64.29 R5.1
N$14
  Top 0.508: T6.3 116.68,46.04 116.68,42.86 116.36,42.55 LED6.K | U$6.COIL0 103.19,48.26 103.19,42.55 108.27,37.47 109.22,37.47 D6.A
  Bottom 0.508: LED6.K 116.2,42.39 113.98,42.39 109.22,37.62 D6.A
N$15
  Top 0.508: T6.1 118.9,45.09 118.9,40.48 116.84,38.42 115.73,38.42 114.78,39.37 114.78,46.67 R6.1
N$16  (via drill 0.61)
  Top 0.508: T7.3 116.84,29.05 116.84,25.72 116.52,25.4 LED7.K | v103.19,21.27 103.19,31.59 U$7.COIL0
  Bottom 0.508: v103.19,21.27 108.43,21.27 109.06,20.64 D7.A 109.22,20.8 113.82,25.4 LED7.K
N$17
  Top 0.508: T7.1 119.06,28.1 119.06,23.34 117.16,21.43 115.89,21.43 114.94,22.38 114.94,29.53 R7.1
N$18  (via drill 0.61)
  Top 0.508: v50.8,30 50.8,41.28 48.42,43.66 48.42,49.85 47.78,50.48 C1.+
  Bottom 0.508: v50.8,30 54.13,30 IC1.2
N$19  (via drill 0.61)
  Top 0.508: T8.3 116.52,12.38 116.52,8.41 LED8.K | v104.62,4.13 103.5,5.24 103.5,14.76 U$8.COIL0
  Bottom 0.508: v104.62,4.13 108.74,4.13 108.9,3.97 D8.A 109.22,3.97 113.51,8.26 116.36,8.26 LED8.K
N$20
  Top 0.508: IC1.6 54.13,40.16 54.13,40.48 51.75,42.86 51.75,50.16 C2.-
N$21  (via drill 0.61)
  Top 0.508: Q2.2 64.77,31.91 68.42,28.26 69.22,28.26 U2.7 | v61.12,32.54 62.71,34.13 62.71,38.73 C7.2
  Bottom 0.508: v61.12,32.54 63.98,32.54 64.77,33.34 Q2.2
N$22  (via drill 0.61)
  Top 0.508: 65.72,27.62 64.77,28.58 Q2.1 | 65.72,27.62 65.88,27.46 69.22,27.46 U2.8 | v58.58,23.65 58.58,25.24 C8.2 | 65.72,27.62 v63.02,24.92
  Bottom 0.508: v58.58,23.65 61.75,23.65 v63.02,24.92
N$23
  Bottom 0.508: IC1.1 54.13,27.3 54.13,23.18 52.07,21.11 C3.+
N$24
  Bottom 0.508: IC1.4 54.13,34.92 48.42,29.21 48.42,21.91 47.94,21.43 C4.+
N$25  (via drill 0.61)
  Top 0.508: v43.81,28.58 43.81,22.86 45.24,21.43 C4.-
  Bottom 0.508: v43.81,28.58 43.81,29.53 45.4,31.12 47.47,31.12 53.82,37.47 54.13,37.47 IC1.5
N$26
  Bottom 0.508: IC1.3 54.29,32.39 56.04,30.64 56.04,22.54 54.61,21.11 C3.-
N$27
  Top 0.508: T8.1 118.59,11.43 118.59,5.87 117,4.29 115.25,4.29 112.87,6.67 110.65,6.67 110.33,6.99 110.33,9.05 114.14,12.86 R8.1
N$28
  Top 0.508: INDIODE.A 67.94,14.29 67.31,14.29 63.98,17.62 F1.P$2
N$29
  Top 0.508: RLED1.2 11.91,7.3 14.29,7.3 16.51,5.08 LED1.A
N$30  (via drill 0.61)
  Top 0.508: v44.77,49.05 44.77,37.15 45.56,36.35 47.62,36.35 49.21,34.77 49.21,31.75 48.89,31.43 48.89,25.56 52.07,22.38 55.24,22.38 55.88,21.75 58.74,21.75 F2.P$1
  Bottom 0.508: v44.77,49.05 42.86,50.96 42.86,65.25 44.45,66.83 46.51,66.83 50.16,63.18 50.16,61.12 J1.PWR
N$32
  Top 0.508: RLED2.2 11.91,24.29 14.76,24.29 16.51,22.54 LED2.A
N$34
  Top 0.508: RLED3.2 11.75,41.28 14.29,41.28 16.51,39.05 LED3.A
N$36
  Top 0.508: RLED4.2 11.91,58.74 13.97,58.74 16.51,56.2 LED4.A
N$38  (via drill 0.61)
  Top 0.508: v113.82,58.26 111.92,60.17 RLED5.2
  Bottom 0.508: v113.82,58.26 115.57,58.26 116.36,57.47 LED5.A
N$40  (via drill 0.61)
  Top 0.508: v113.66,40.64 111.92,42.39 RLED6.2
  Bottom 0.508: v113.66,40.64 115.57,40.64 LED6.A
N$42  (via drill 0.61)
  Top 0.508: v113.82,23.34 111.92,25.24 RLED7.2
  Bottom 0.508: v113.82,23.34 115.89,23.34 116.36,22.86 LED7.A
N$44
  Top 0.508: RLED8.2 111.92,7.94 114.3,7.94 116.36,5.87 LED8.A
PIN13  (via drill 0.61)
  Top 0.508: v65.72,55.88 63.98,54.13 45.72,54.13 42.86,51.28 42.86,33.97 45.56,31.27 47.62,31.27 48.42,32.07 48.42,33.18 46.67,34.92 IC1.13
  Bottom 0.508: v65.72,55.88 70.01,55.88 71.6,57.47 DB9.3
RL1  (via drill 0.61)
  Top 0.508: v70.48,37.62 70.48,35.56 70.8,35.24 70.8,34.61 U2.32 | 82.07,41.91 84.14,41.91 84.3,41.75 SV1.8 | 82.07,41.91 v75.09,41.91 | v22.7,17.62 19.21,14.13 19.21,12.07 R1.2 | v64.45,50.96 75.09,50.96 82.07,43.97 82.07,41.91
  Bottom 0.508: v70.48,37.62 70.8,37.62 71.28,38.1 71.91,38.1 75.09,41.28 v75.09,41.91 | v22.7,17.62 27.78,17.62 44.77,34.61 44.77,40.64 45.56,41.43 50.64,41.43 53.18,43.97 55.24,43.97 57.15,45.88 57.15,51.75 58.1,52.7 62.71,52.7 v64.45,50.96
RL1IN1
  Bottom 1.778: RL1.1 9.84,5.88 14.88,10.92 18.54,10.92 20.98,8.48 25.09,8.48 U$1.SWCOMMON
RL1IN2
  Bottom 1.778: RL1.2 8.14,10.88 13.06,15.8 23.22,15.8 24.43,14.58 24.43,13.56 25.86,12.14 36.75,12.14 U$1.SWOPEN
RL2  (via drill 0.61)
  Top 0.508: v68.58,38.1 69.53,37.15 69.53,33.66 69.37,33.5 69.37,33.18 U2.1 | v73.18,40.8 82.55,40.8 84.3,39.05 SV1.7 84.45,39.21 87.15,41.91 v87.15,48.89 | v63.66,55.25 44.61,55.25 19.05,29.69 19.05,29.05 R2.2
  Bottom 0.508: v68.58,38.1 68.58,40 69.37,40.8 v73.18,40.8 | v63.66,55.25 64.93,55.25 66.83,53.34 80.17,53.34 83.03,50.48 85.57,50.48 v87.15,48.89
RL2IN1
  Bottom 1.778: RL2.1 9.23,22.34 14.88,27.99 18.54,27.99 21.59,24.94 25.09,24.94 U$2.SWCOMMON
RL2IN2
  Bottom 1.778: RL2.2 7.94,27.34 13.46,32.87 22.81,32.87 24.84,30.84 24.84,29.82 26.26,28.4 36.54,28.4 U$2.SWOPEN
RL3  (via drill 0.61)
  Top 0.508: v68.42,33.97 68.1,33.66 68.1,32.54 68.42,32.23 69.22,32.23 U2.2 | v57.15,26.67 56.83,26.67 54.13,23.97 52.7,23.97 51.91,24.77 51.91,41.59 v49.53,43.97 | v20.32,45.4 18.73,45.4 R3.2
  Bottom 0.508: v68.42,33.97 60.8,26.35 57.47,26.35 v57.15,26.67 | v20.32,45.4 21.75,43.97 v49.53,43.97 49.69,43.81 55.56,49.69 55.56,51.28 57.78,53.5 63.02,53.5 63.98,52.55 73.5,52.55 78.1,47.94 85.57,47.94 87.15,46.36 87.15,39.37 84.45,36.67 SV1.6
RL3IN1
  Bottom 1.778: RL3.1 9.64,39 15.09,44.45 18.95,44.45 21.79,41.61 25.09,41.61 U$3.SWCOMMON
RL3IN2
  Bottom 1.778: RL3.2 7.73,44 12.85,49.12 22.4,49.12 26.06,45.47 36.95,45.47 U$3.SWOPEN
RL4  (via drill 0.61)
  Top 0.508: v71.28,13.81 66.2,18.89 66.2,21.91 70.17,25.88 70.8,25.88 U2.9 | v76.68,13.81 79.22,11.27 85.88,11.27 89.38,14.76 89.38,30 88.11,31.27 | 88.11,31.27 85.41,33.97 84.45,33.97 SV1.5 | R4.2 19.21,63.02 26.03,69.85 68.74,69.85 88.26,50.32 88.26,31.43 88.11,31.27
  Bottom 0.508: v76.68,13.81 v71.28,13.81
RL4IN1
  Bottom 1.778: RL4.1 9.18,56.22 14.68,61.72 18.95,61.72 22.4,58.27 25.09,58.27 U$4.SWCOMMON
RL4IN2
  Bottom 1.778: RL4.2 8.49,61.22 13.06,65.79 22.61,65.79 26.87,61.52 36.34,61.52 U$4.SWOPEN
RL5  (via drill 0.61)
  Top 0.508: v76.52,31.75 75.41,31.75 71.6,27.94 71.6,26.04 U2.10 | v110.33,63.5 111.12,64.29 111.92,64.29 R5.2
  Bottom 0.508: v76.52,31.75 84.14,31.75 84.3,31.59 SV1.4 84.45,31.59 104.62,51.75 108.43,51.75 111.28,54.61 124.78,54.61 127,56.83 127,57.94 126.05,58.9 125.25,58.9 120.65,63.5 v110.33,63.5
RL5IN1
  Bottom 1.778: RL5.1 123.89,62.44 118.11,68.22 109.37,68.22 106.32,65.18 106.32,60.34 U$5.SWCOMMON
RL5IN2
  Bottom 1.778: RL5.2 123.61,57.44 118.92,62.13 111.4,62.13 105.72,56.44 94.42,56.44 U$5.SWOPEN
RL6  (via drill 0.61)
  Top 0.508: v75.72,30.64 72.39,27.3 72.39,26.04 U2.11 | v110.17,41.12 110.17,43.34 111.76,44.93 111.76,46.67 R6.2
  Bottom 0.508: v75.72,30.64 82.55,30.64 84.3,28.89 SV1.3 84.45,29.05 97.79,29.05 109.85,41.12 v110.17,41.12
RL6IN1
  Bottom 1.778: RL6.1 124.14,45.32 119.13,50.34 108.36,50.34 106.12,48.11 106.12,43.28 U$6.SWCOMMON
RL6IN2
  Bottom 1.778: RL6.2 122.84,40.32 118.52,44.65 111.4,44.65 105.92,39.17 94.01,39.17 U$6.SWOPEN
RL7  (via drill 0.61)
  Top 0.508: v73.82,24.45 73.18,25.08 73.18,25.88 U2.12 | v82.07,24.45 82.39,24.45 84.3,26.35 SV1.2 84.45,26.51 85.88,27.94 v86.68,27.94 | v110.33,29.53 111.92,29.53 R7.2
  Bottom 0.508: v82.07,24.45 v73.82,24.45 | v110.33,29.53 110.33,28.89 105.73,24.29 90.33,24.29 v86.68,27.94
RL7IN1
  Bottom 1.778: RL7.1 122.42,28.76 117.09,34.09 108.97,34.09 105.72,30.84 105.72,26.21 U$7.SWCOMMON
RL7IN2
  Bottom 0.508: 91.28,19.69 U$7.SWOPEN | 93.98,22.38 94.42,22.91
  Bottom 1.778: RL7.2 121.93,23.76 117.91,27.79 112.01,27.79 107.14,22.91 94.42,22.91 | 93.98,22.38 91.28,19.69
RL8  (via drill 0.61)
  Top 0.508: v73.98,27.46 73.98,26.04 U2.13 | v106.68,18.26 111.28,13.65 111.28,13.02 R8.2
  Bottom 0.508: v73.98,27.46 80.64,27.46 84.3,23.81 SV1.1 84.3,23.65 89.69,18.26 v106.68,18.26
RL8IN1
  Bottom 1.778: RL8.1 123.74,11.19 117.91,17.02 108.56,17.02 106.12,14.58 106.12,9.54 U$8.SWCOMMON
RL8IN2
  Bottom 1.778: RL8.2 122.64,6.19 118.11,10.72 111,10.72 106.12,5.84 94.42,5.84 U$8.SWOPEN
RST1  (via drill 0.61)
  Top 0.508: 73.18,35.88 73.18,36.67 70.64,39.21 RST2.2 70.33,39.37 68.26,41.43 65.72,41.43 C10.1 | 73.18,35.88 73.18,34.61 U2.29 | RST.2 79.38,21.11 76.04,21.11 PROGRAMMER1.1 | v73.02,35.88 73.18,35.88
  Bottom 0.508: 74.45,34.45 74.29,34.29 74.29,29.21 72.71,27.62 72.71,24.13 75.88,20.96 PROGRAMMER1.1 | 74.45,34.45 76.99,36.99 76.99,39.21 RST2.1 | 74.45,34.45 v73.02,35.88
RXD  (via drill 0.61)
  Top 0.508: v71.6,35.88 71.6,34.61 U2.31 71.6,34.29 71.6,33.66 v70.96,33.02 | v57.31,23.81 56.67,23.18 52.39,23.18 49.69,25.88 49.69,30.32 50.01,30.64 50.01,36.67 46.67,40 IC1.11
  Bottom 0.508: v71.6,35.88 71.6,34.92 73.5,33.02 73.5,29.53 71.91,27.94 71.91,22.54 73.34,21.11 PROGRAMMER1.3 | v57.31,23.81 59.05,25.56 62.23,25.56 64.13,27.46 65.41,27.46 v70.96,33.02
SCK1  (via drill 0.61)
  Top 0.508: v77.95,22.7 77.95,27.3 U2.17
  Bottom 0.508: v77.95,22.7 77.95,22.23 78.1,22.07 78.1,18.89 76.52,17.3 74.61,17.3 73.5,18.41 PROGRAMMER1.4
SWITCH  (via drill 0.61)
  Top 0.508: v75.72,28.58 75.72,27.78 74.77,26.83 74.77,26.04 U2.14 | v87.95,21.43 87.95,18.41 84.61,15.08 STATE_REM.2
  Bottom 0.508: v75.72,28.58 76.04,28.58 76.36,28.26 82.39,28.26 83.03,27.62 85.57,27.62 87.95,25.24 v87.95,21.43
TXD  (via drill 0.61)
  Top 0.508: v72.39,30.16 72.39,34.45 U2.30
  Bottom 0.508: PROGRAMMER1.5 70.96,21.11 70.96,28.1 72.39,29.53 v72.39,30.16 72.23,30.32 72.23,33.18 70.33,35.08 68.1,35.08 67.31,34.29 67.31,33.97 60.48,27.15 58.1,27.15 57.15,28.1 57.15,36.99 55.4,38.73 53.02,38.73 51.91,37.62 46.67,37.62 IC1.12
VDD  (via drill 0.61)
  Top 0.508: SV2.10 59.21,51.44 54.93,51.44 54.45,51.91 46.51,51.91 45.24,50.64 C1.- | 78.74,28.26 77.95,28.26 U2.18 | 78.74,28.26 79.06,28.58 79.06,29.53 78.74,29.84 77.95,29.84 U2.20 | 78.74,28.26 80.17,26.83 80.17,23.02 80.96,22.23 80.96,20 79.53,18.57 RST.1 | PROGRAMMER1.2 76.04,18.57 79.22,18.57 RST.1 | 80.17,16.83 78.58,18.41 RST.1 | 80.17,16.83 84.45,12.54 STATE_REM.3 | 63.5,12.07 63.5,14.13 C15.1 | 63.5,12.07 59.53,8.1 RLED.1 59.21,8.1 58.58,8.1 53.82,12.86 C17.+ 53.5,13.02 50.8,15.72 50.8,21.43 46.67,25.56 46.67,27.3 IC1.16 46.51,27.62 41.75,32.39 v41.75,45.09 | 75.56,8.89 66.83,8.89 63.66,12.07 63.5,12.07 | 75.56,8.89 U1.OUT | 70.48,29.37 70.17,29.05 69.37,29.05 U2.6 | 70.48,29.37 70.48,30.32 70.17,30.64 69.37,30.64 U2.4 | v70.8,29.37 70.48,29.37 | 80.17,16.83 78.9,15.56 76.99,15.56 75.56,14.13 75.56,8.89
  Bottom 0.508: SV1.10 84.3,46.83 78.1,46.83 75.09,49.85 60.8,49.85 59.37,51.28 SV2.10 | v70.8,29.37 70.8,29.05 65.41,23.65 65.41,21.11 61.59,17.3 60.64,17.3 56.36,13.02 53.66,13.02 C17.+ | v41.75,45.09 42.23,45.09 45.88,48.74 45.88,49.37 45.24,50.01 45.24,50.48 C1.-
VSS  (via drill 0.61)
  Top 0.508: J1.GNDBREAK 45.56,64.14 47.31,64.14 50.16,66.99 J1.GND | SV1.9 84.45,44.29 86.36,46.2 86.36,47.31 84.45,49.21 SV1.11 84.14,49.37 77.31,56.2 77.31,57.47 DB9.5 | C2.+ 54.29,50.16 55.56,48.89 59.21,48.89 SV2.9 59.53,48.74 65.09,43.18 | RST2.3 76.99,43.97 70.64,43.97 RST2.4 70.33,43.81 65.72,43.81 65.09,43.18 | 68.26,31.27 68.42,31.43 69.22,31.43 U2.3 | 68.26,31.27 68.1,31.12 68.1,30.16 68.42,29.84 69.22,29.84 U2.5 | 68.26,31.27 66.04,33.5 66.04,34.61 | 66.04,34.61 66.04,38.58 65.88,38.73 C7.1 65.56,38.89 63.02,41.43 C10.2 63.34,41.43 65.09,43.18 | 10.32,25.72 10.32,12.07 11.91,10.48 T1.2 11.91,10.16 10.32,8.57 10.32,3.65 12.7,1.27 32.23,1.27 45.24,14.29 C16.- | 10.32,25.72 11.59,26.99 T2.2 | 10.32,42.55 10.16,42.39 10.16,25.88 10.32,25.72 | 10.32,42.55 11.43,43.66 11.43,43.97 T3.2 | T4.2 12.06,61.28 11.75,61.28 10.16,59.69 10.16,42.7 10.32,42.55 | 120.02,29.21 119.22,30 T7.2 | 120.02,29.21 120.33,28.89 120.33,23.5 118.74,21.91 118.74,13.49 T8.2 118.9,13.34 120.02,12.22 120.02,6.19 115.41,1.59 94.3,1.59 88.58,7.3 81.28,7.3 80.33,6.35 U1.GND | 119.86,46.2 120.17,45.88 120.17,29.37 120.02,29.21 | 119.86,46.2 119.06,46.99 T6.2 | T5.2 118.9,64.61 120.02,63.5 120.02,46.36 119.86,46.2 | v82.07,20 82.07,22.23 80.96,23.34 80.96,28.73 79.06,30.64 77.95,30.64 U2.21 | C17.- 53.66,15.4 54.77,14.29 60.8,14.29 C15.2 60.96,14.45 62.07,15.56 62.07,19.37 | 62.07,19.37 62.07,23.18 61.44,23.81 61.44,25.24 C8.1 61.59,25.4 62.23,26.04 62.23,32.54 64.29,34.61 66.04,34.61 | 62.07,19.37 v65.09,19.37
  Bottom 0.508: SV1.9 84.3,44.29 81.44,44.29 81.28,44.45 77.63,44.45 77.15,43.97 RST2.3 | J1.GNDBREAK 45.56,63.98 45.56,58.9 54.13,50.32 C2.+ | 82.71,19.37 84.45,17.62 STATE_REM.1 | 82.71,19.37 v82.07,20 | 82.55,15.56 82.55,19.21 82.71,19.37 | 82.55,15.56 82.55,8.57 80.33,6.35 U1.GND | v65.09,19.37 66.67,20.96 68.26,20.96 PROGRAMMER1.7 | IC1.15 46.51,29.84 43.66,26.99 43.66,16.03 45.24,14.45 C16.- 45.4,14.13 48.82,10.72 | 48.82,10.72 51.75,7.78 53.66,7.78 LED.K | 48.82,10.72 50.01,11.91 | 50.01,11.91 C17.- | 82.55,15.56 76.99,15.56 76.36,14.92 70.64,14.92 67.47,11.75 50.16,11.75 50.01,11.91
  pour Top (isolate 0.61): 43.18,74.93 43.18,0 86.36,0 86.36,74.93
  pour Bottom (isolate 0.61): 43.18,74.93 43.18,0 86.36,0 86.36,74.93